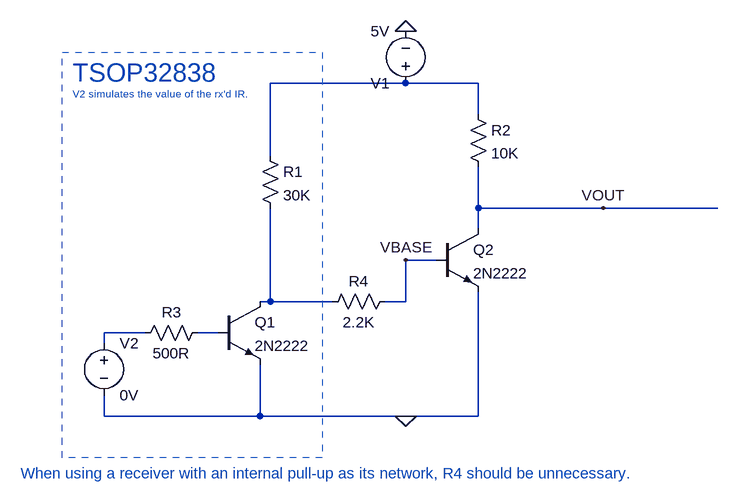
[diagram p0: schematic receiver.asc]
receiver.asc, the LTspice schematic file:
Version 4
SHEET 1 944 680
WIRE 384 -336 176 -336
WIRE 496 -336 384 -336
WIRE 496 -288 496 -336
WIRE 176 -224 176 -336
WIRE 496 -144 496 -208
WIRE 688 -144 496 -144
WIRE 864 -144 688 -144
WIRE 496 -112 496 -144
WIRE 432 -64 384 -64
WIRE 176 0 176 -144
WIRE 176 0 160 0
WIRE 272 0 176 0
WIRE 384 0 384 -64
WIRE 384 0 352 0
WIRE -16 48 -80 48
WIRE 96 48 64 48
WIRE -80 64 -80 48
WIRE -80 176 -80 144
WIRE 160 176 160 96
WIRE 160 176 -80 176
WIRE 384 176 160 176
WIRE 496 176 496 -16
WIRE 496 176 384 176
FLAG 688 -144 VOUT
FLAG 384 -64 VBASE
FLAG 384 -416 0
FLAG 384 176 0
SYMBOL npn 96 0 R0
SYMATTR InstName Q1
SYMATTR Value 2N2222
SYMBOL npn 432 -112 R0
SYMATTR InstName Q2
SYMATTR Value 2N2222
SYMBOL res 160 -240 R0
SYMATTR InstName R1
SYMATTR Value 30K
SYMBOL res 480 -304 R0
SYMATTR InstName R2
SYMATTR Value 10K
SYMBOL voltage 384 -320 R180
WINDOW 123 0 0 Left 2
WINDOW 39 0 0 Left 2
SYMATTR InstName V1
SYMATTR Value 5V
SYMBOL res 80 32 R90
WINDOW 0 0 56 VBottom 2
WINDOW 3 32 56 VTop 2
SYMATTR InstName R3
SYMATTR Value 500R
SYMBOL res 368 -16 R90
WINDOW 0 0 56 VBottom 2
WINDOW 3 32 56 VTop 2
SYMATTR InstName R4
SYMATTR Value 2.2K
SYMBOL voltage -80 48 R0
WINDOW 123 0 0 Left 2
WINDOW 39 0 0 Left 2
SYMATTR InstName V2
SYMATTR Value 0V
TEXT -128 -352 Left 4 ;TSOP32838
TEXT -208 264 Left 2 ;When using a receiver with an internal pull-up as its network, R4 should be unnecessary.
TEXT -128 -320 Left 1 ;V2 simulates the value of the rx'd IR.
RECTANGLE Normal 256 240 -144 -384 2

The netlist it stands for:
* receiver.asc
Q1 N002 N004 0 0 2N2222
Q2 VOUT VBASE 0 0 2N2222
R1 N001 N002 30K
R2 N001 VOUT 10K
V1 N001 0 5V
R3 N004 N003 500R
R4 VBASE N002 2.2K
V2 N003 0 0V
.model NPN NPN
.model PNP PNP
.lib standard.bjt
* TSOP32838
* When using a receiver with an internal pull-up as its network, R4 should be unnecessary.
* V2 simulates the value of the rx'd IR.
.backanno
.end